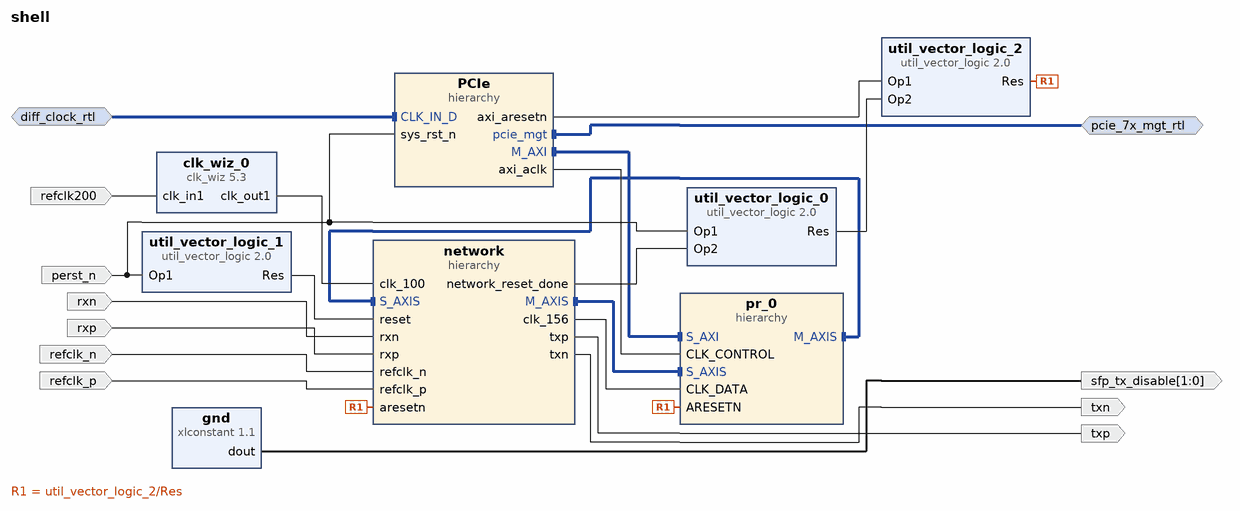
[diagram p0: block diagram of the top level]
# Vivado block design shell, xcku115-flva1517-2-e, Vivado 2016.4
create_bd_design shell

create_bd_intf_port -mode Master -vlnv xilinx.com:interface:pcie_7x_mgt_rtl:1.0 pcie_7x_mgt_rtl
create_bd_intf_port -mode Slave -vlnv xilinx.com:interface:diff_clock_rtl:1.0 diff_clock_rtl
set_property -dict {CONFIG.FREQ_HZ 100000000} [get_bd_intf_ports diff_clock_rtl]
create_bd_port -dir I rxn
create_bd_port -dir I rxp
create_bd_port -dir I refclk_n
create_bd_port -dir O txp
create_bd_port -dir O txn
create_bd_port -dir I refclk_p
create_bd_port -dir I perst_n
create_bd_port -dir I -type clk refclk200
set_property -dict {CONFIG.FREQ_HZ 200000000} [get_bd_ports refclk200]
create_bd_port -dir O -from 1 -to 0 sfp_tx_disable

create_bd_cell -type hier network
create_bd_cell -type ip -vlnv xilinx.com:ip:util_vector_logic:2.0 util_vector_logic_0
set_property -dict {CONFIG.C_SIZE 1} [get_bd_cells util_vector_logic_0]
create_bd_cell -type ip -vlnv xilinx.com:ip:util_vector_logic:2.0 util_vector_logic_1
set_property -dict {CONFIG.C_SIZE 1 CONFIG.C_OPERATION not} [get_bd_cells util_vector_logic_1]
create_bd_cell -type ip -vlnv xilinx.com:ip:clk_wiz:5.3 clk_wiz_0
set_property -dict {CONFIG.USE_LOCKED false CONFIG.USE_RESET false} [get_bd_cells clk_wiz_0]
create_bd_cell -type ip -vlnv xilinx.com:ip:xlconstant:1.1 gnd
set_property -dict {CONFIG.CONST_WIDTH 2 CONFIG.CONST_VAL 0} [get_bd_cells gnd]
create_bd_cell -type hier PCIe
create_bd_cell -type ip -vlnv xilinx.com:ip:util_vector_logic:2.0 util_vector_logic_2
set_property -dict {CONFIG.C_SIZE 1} [get_bd_cells util_vector_logic_2]
create_bd_cell -type hier pr_0

# ---- hierarchy /network ----
current_bd_instance /network
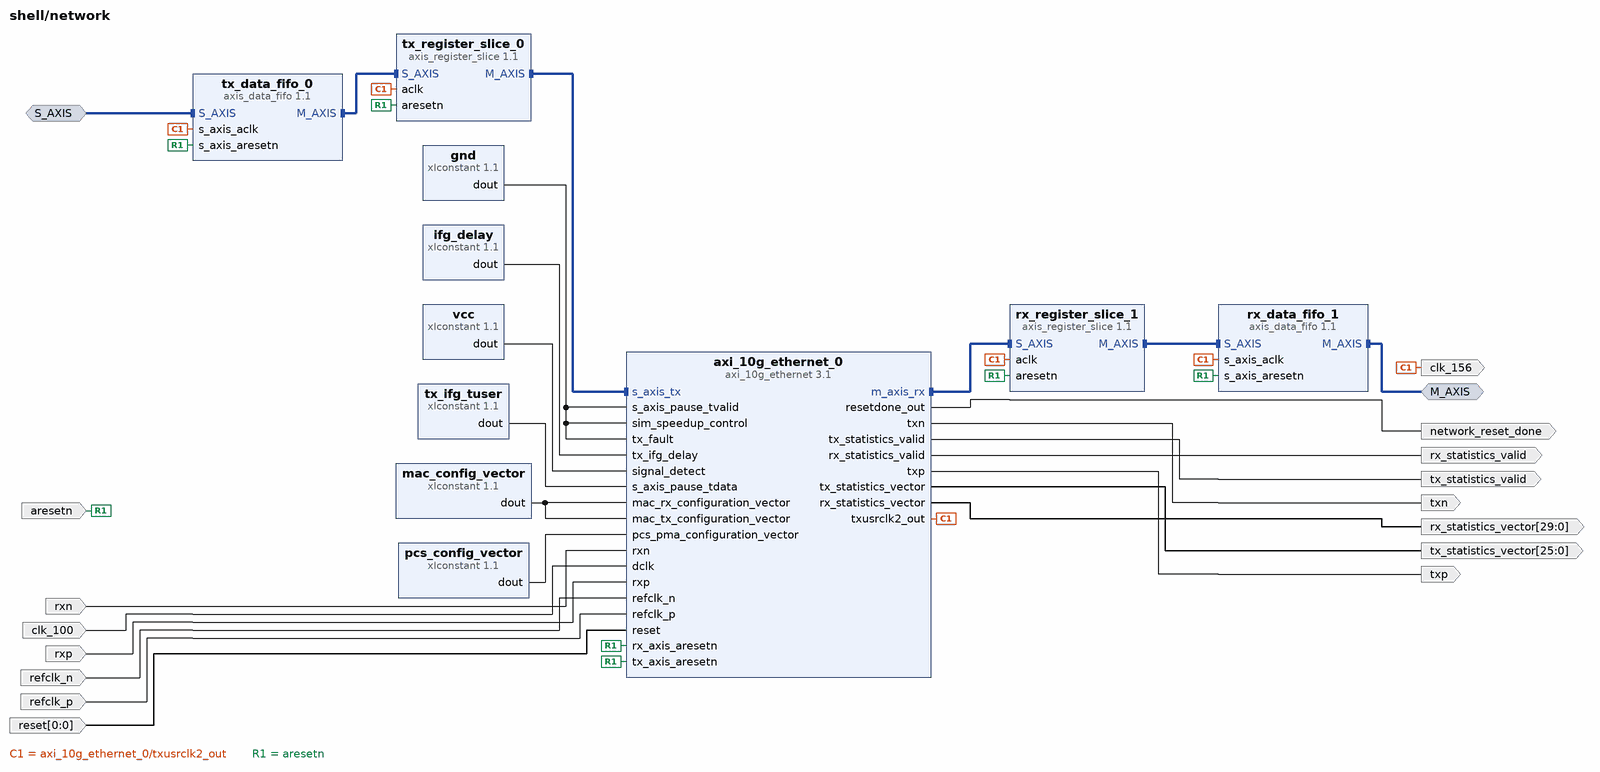
[diagram p1: block diagram inside /network]
create_bd_intf_pin -mode Slave -vlnv xilinx.com:interface:axis_rtl:1.0 S_AXIS
create_bd_intf_pin -mode Master -vlnv xilinx.com:interface:axis_rtl:1.0 M_AXIS
create_bd_pin -dir I rxn
create_bd_pin -dir I -type clk clk_100
create_bd_pin -dir I rxp
create_bd_pin -dir O -type clk clk_156
create_bd_pin -dir I -type rst aresetn
create_bd_pin -dir I refclk_n
create_bd_pin -dir O txp
create_bd_pin -dir O txn
create_bd_pin -dir O network_reset_done
create_bd_pin -dir I refclk_p
create_bd_pin -dir I -from 0 -to 0 -type rst reset
create_bd_pin -dir O tx_statistics_valid
create_bd_pin -dir O -from 25 -to 0 tx_statistics_vector
create_bd_pin -dir O rx_statistics_valid
create_bd_pin -dir O -from 29 -to 0 rx_statistics_vector

create_bd_cell -type ip -vlnv xilinx.com:ip:xlconstant:1.1 gnd
set_property -dict {CONFIG.CONST_VAL 0} [get_bd_cells gnd]
create_bd_cell -type ip -vlnv xilinx.com:ip:axis_register_slice:1.1 tx_register_slice_0
set_property -dict {CONFIG.TUSER_WIDTH 0} [get_bd_cells tx_register_slice_0]
create_bd_cell -type ip -vlnv xilinx.com:ip:axi_10g_ethernet:3.1 axi_10g_ethernet_0
set_property -dict [list \
  CONFIG.Management_Interface false \
  CONFIG.base_kr BASE-R \
  CONFIG.SupportLevel 1 \
  CONFIG.Locations X1Y16 \
] [get_bd_cells axi_10g_ethernet_0]
create_bd_cell -type ip -vlnv xilinx.com:ip:xlconstant:1.1 mac_config_vector
set_property -dict {CONFIG.CONST_WIDTH 80 CONFIG.CONST_VAL 22} [get_bd_cells mac_config_vector]
create_bd_cell -type ip -vlnv xilinx.com:ip:xlconstant:1.1 tx_ifg_tuser
set_property -dict {CONFIG.CONST_WIDTH 16 CONFIG.CONST_VAL 0} [get_bd_cells tx_ifg_tuser]
create_bd_cell -type ip -vlnv xilinx.com:ip:xlconstant:1.1 ifg_delay
set_property -dict {CONFIG.CONST_WIDTH 8 CONFIG.CONST_VAL 0} [get_bd_cells ifg_delay]
create_bd_cell -type ip -vlnv xilinx.com:ip:xlconstant:1.1 vcc
create_bd_cell -type ip -vlnv xilinx.com:ip:xlconstant:1.1 pcs_config_vector
set_property -dict {CONFIG.CONST_WIDTH 536 CONFIG.CONST_VAL 0} [get_bd_cells pcs_config_vector]
create_bd_cell -type ip -vlnv xilinx.com:ip:axis_register_slice:1.1 rx_register_slice_1
set_property -dict {CONFIG.TUSER_WIDTH 0} [get_bd_cells rx_register_slice_1]
create_bd_cell -type ip -vlnv xilinx.com:ip:axis_data_fifo:1.1 rx_data_fifo_1
set_property -dict {CONFIG.FIFO_MODE 2} [get_bd_cells rx_data_fifo_1]
create_bd_cell -type ip -vlnv xilinx.com:ip:axis_data_fifo:1.1 tx_data_fifo_0
set_property -dict {CONFIG.FIFO_MODE 2} [get_bd_cells tx_data_fifo_0]

# ---- hierarchy /PCIe ----
current_bd_instance /PCIe
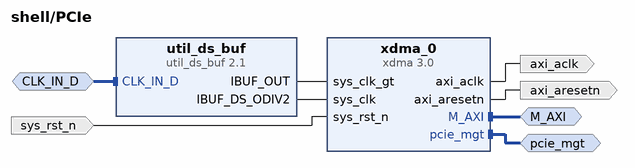
[diagram p2: block diagram inside /PCIe]
create_bd_intf_pin -mode Master -vlnv xilinx.com:interface:pcie_7x_mgt_rtl:1.0 pcie_mgt
create_bd_intf_pin -mode Master -vlnv xilinx.com:interface:aximm_rtl:1.0 M_AXI
create_bd_intf_pin -mode Slave -vlnv xilinx.com:interface:diff_clock_rtl:1.0 CLK_IN_D
create_bd_pin -dir I -type rst sys_rst_n
create_bd_pin -dir O -type clk axi_aclk
create_bd_pin -dir O -type rst axi_aresetn

create_bd_cell -type ip -vlnv xilinx.com:ip:xdma:3.0 xdma_0
set_property -dict [list \
  CONFIG.mode_selection Advanced \
  CONFIG.pl_link_cap_max_link_width X8 \
  CONFIG.pl_link_cap_max_link_speed 8.0_GT/s \
  CONFIG.axi_data_width 256_bit \
  CONFIG.axisten_freq 250 \
  CONFIG.pf0_device_id 8038 \
  CONFIG.pf0_interrupt_pin NONE \
  CONFIG.xdma_rnum_chnl 4 \
  CONFIG.xdma_wnum_chnl 4 \
  CONFIG.INS_LOSS_NYQ 5 \
  CONFIG.xdma_axi_intf_mm AXI_Memory_Mapped \
  CONFIG.cfg_mgmt_if false \
  CONFIG.ins_loss_profile Chip-to-Chip \
] [get_bd_cells xdma_0]
create_bd_cell -type ip -vlnv xilinx.com:ip:util_ds_buf:2.1 util_ds_buf
set_property -dict {CONFIG.C_BUF_TYPE IBUFDSGTE} [get_bd_cells util_ds_buf]

# ---- hierarchy /pr_0 ----
current_bd_instance /pr_0
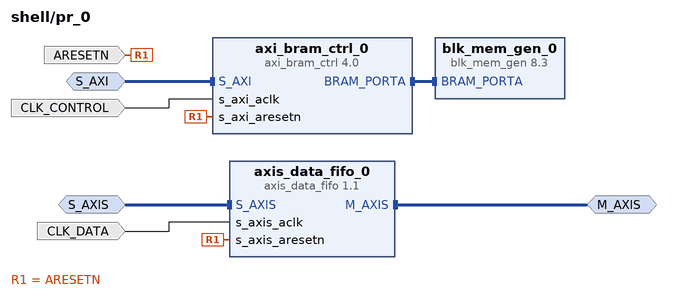
[diagram p3: block diagram inside /pr_0]
create_bd_intf_pin -mode Slave -vlnv xilinx.com:interface:aximm_rtl:1.0 S_AXI
create_bd_intf_pin -mode Master -vlnv xilinx.com:interface:axis_rtl:1.0 M_AXIS
create_bd_intf_pin -mode Slave -vlnv xilinx.com:interface:axis_rtl:1.0 S_AXIS
create_bd_pin -dir I -type clk CLK_CONTROL
create_bd_pin -dir I -type rst ARESETN
create_bd_pin -dir I -type clk CLK_DATA

create_bd_cell -type ip -vlnv xilinx.com:ip:axi_bram_ctrl:4.0 axi_bram_ctrl_0
set_property -dict {CONFIG.DATA_WIDTH 256 CONFIG.SINGLE_PORT_BRAM 1} [get_bd_cells axi_bram_ctrl_0]
create_bd_cell -type ip -vlnv xilinx.com:ip:blk_mem_gen:8.3 blk_mem_gen_0
create_bd_cell -type ip -vlnv xilinx.com:ip:axis_data_fifo:1.1 axis_data_fifo_0

# ---- connections ----

current_bd_instance /network
connect_bd_intf_net -intf_net axis_register_slice_0_M_AXIS [get_bd_intf_pins tx_register_slice_0/M_AXIS] [get_bd_intf_pins axi_10g_ethernet_0/s_axis_tx]
connect_bd_intf_net [get_bd_intf_pins axi_10g_ethernet_0/m_axis_rx] [get_bd_intf_pins rx_register_slice_1/S_AXIS]
connect_bd_intf_net -intf_net axis_register_slice_1_M_AXIS [get_bd_intf_pins rx_register_slice_1/M_AXIS] [get_bd_intf_pins rx_data_fifo_1/S_AXIS]
connect_bd_intf_net -intf_net axis_data_fifo_0_M_AXIS [get_bd_intf_pins tx_data_fifo_0/M_AXIS] [get_bd_intf_pins tx_register_slice_0/S_AXIS]
connect_bd_intf_net [get_bd_intf_pins S_AXIS] [get_bd_intf_pins tx_data_fifo_0/S_AXIS]
connect_bd_intf_net [get_bd_intf_pins M_AXIS] [get_bd_intf_pins rx_data_fifo_1/M_AXIS]
connect_bd_net [get_bd_pins gnd/dout] \
  [get_bd_pins axi_10g_ethernet_0/s_axis_pause_tvalid] [get_bd_pins axi_10g_ethernet_0/tx_fault] \
  [get_bd_pins axi_10g_ethernet_0/sim_speedup_control]
connect_bd_net [get_bd_pins ifg_delay/dout] [get_bd_pins axi_10g_ethernet_0/tx_ifg_delay]
connect_bd_net [get_bd_pins vcc/dout] [get_bd_pins axi_10g_ethernet_0/signal_detect]
connect_bd_net [get_bd_pins tx_ifg_tuser/dout] [get_bd_pins axi_10g_ethernet_0/s_axis_pause_tdata]
connect_bd_net [get_bd_pins mac_config_vector/dout] \
  [get_bd_pins axi_10g_ethernet_0/mac_tx_configuration_vector] [get_bd_pins axi_10g_ethernet_0/mac_rx_configuration_vector]
connect_bd_net [get_bd_pins pcs_config_vector/dout] [get_bd_pins axi_10g_ethernet_0/pcs_pma_configuration_vector]
connect_bd_net [get_bd_pins rxn] [get_bd_pins axi_10g_ethernet_0/rxn]
connect_bd_net -net dclk_1 [get_bd_pins clk_100] [get_bd_pins axi_10g_ethernet_0/dclk]
connect_bd_net [get_bd_pins rxp] [get_bd_pins axi_10g_ethernet_0/rxp]
connect_bd_net [get_bd_pins axi_10g_ethernet_0/txusrclk2_out] \
  [get_bd_pins clk_156] [get_bd_pins rx_register_slice_1/aclk] [get_bd_pins tx_register_slice_0/aclk] \
  [get_bd_pins rx_data_fifo_1/s_axis_aclk] [get_bd_pins tx_data_fifo_0/s_axis_aclk]
connect_bd_net -net tx_axis_aresetn_1 [get_bd_pins aresetn] \
  [get_bd_pins axi_10g_ethernet_0/tx_axis_aresetn] [get_bd_pins axi_10g_ethernet_0/rx_axis_aresetn] \
  [get_bd_pins rx_register_slice_1/aresetn] [get_bd_pins tx_register_slice_0/aresetn] \
  [get_bd_pins rx_data_fifo_1/s_axis_aresetn] [get_bd_pins tx_data_fifo_0/s_axis_aresetn]
connect_bd_net [get_bd_pins refclk_n] [get_bd_pins axi_10g_ethernet_0/refclk_n]
connect_bd_net [get_bd_pins axi_10g_ethernet_0/txp] [get_bd_pins txp]
connect_bd_net [get_bd_pins axi_10g_ethernet_0/txn] [get_bd_pins txn]
connect_bd_net [get_bd_pins axi_10g_ethernet_0/resetdone_out] [get_bd_pins network_reset_done]
connect_bd_net [get_bd_pins refclk_p] [get_bd_pins axi_10g_ethernet_0/refclk_p]
connect_bd_net [get_bd_pins axi_10g_ethernet_0/tx_statistics_valid] [get_bd_pins tx_statistics_valid]
connect_bd_net [get_bd_pins axi_10g_ethernet_0/tx_statistics_vector] [get_bd_pins tx_statistics_vector]
connect_bd_net [get_bd_pins axi_10g_ethernet_0/rx_statistics_valid] [get_bd_pins rx_statistics_valid]
connect_bd_net [get_bd_pins axi_10g_ethernet_0/rx_statistics_vector] [get_bd_pins rx_statistics_vector]
connect_bd_net [get_bd_pins reset] [get_bd_pins axi_10g_ethernet_0/reset]

current_bd_instance /PCIe
connect_bd_intf_net [get_bd_intf_pins pcie_mgt] [get_bd_intf_pins xdma_0/pcie_mgt]
connect_bd_intf_net [get_bd_intf_pins M_AXI] [get_bd_intf_pins xdma_0/M_AXI]
connect_bd_intf_net [get_bd_intf_pins CLK_IN_D] [get_bd_intf_pins util_ds_buf/CLK_IN_D]
connect_bd_net [get_bd_pins sys_rst_n] [get_bd_pins xdma_0/sys_rst_n]
connect_bd_net [get_bd_pins xdma_0/axi_aclk] [get_bd_pins axi_aclk]
connect_bd_net [get_bd_pins xdma_0/axi_aresetn] [get_bd_pins axi_aresetn]
connect_bd_net [get_bd_pins util_ds_buf/IBUF_OUT] [get_bd_pins xdma_0/sys_clk_gt]
connect_bd_net [get_bd_pins util_ds_buf/IBUF_DS_ODIV2] [get_bd_pins xdma_0/sys_clk]

current_bd_instance /pr_0
connect_bd_intf_net [get_bd_intf_pins axi_bram_ctrl_0/BRAM_PORTA] [get_bd_intf_pins blk_mem_gen_0/BRAM_PORTA]
connect_bd_intf_net [get_bd_intf_pins S_AXI] [get_bd_intf_pins axi_bram_ctrl_0/S_AXI]
connect_bd_intf_net [get_bd_intf_pins M_AXIS] [get_bd_intf_pins axis_data_fifo_0/M_AXIS]
connect_bd_intf_net [get_bd_intf_pins S_AXIS] [get_bd_intf_pins axis_data_fifo_0/S_AXIS]
connect_bd_net -net s_axi_aclk_1 [get_bd_pins CLK_CONTROL] [get_bd_pins axi_bram_ctrl_0/s_axi_aclk]
connect_bd_net -net s_axi_aresetn_1 [get_bd_pins ARESETN] [get_bd_pins axi_bram_ctrl_0/s_axi_aresetn] [get_bd_pins axis_data_fifo_0/s_axis_aresetn]
connect_bd_net -net s_axis_aclk_1 [get_bd_pins CLK_DATA] [get_bd_pins axis_data_fifo_0/s_axis_aclk]

current_bd_instance /
connect_bd_intf_net [get_bd_intf_pins PCIe/M_AXI] [get_bd_intf_pins pr_0/S_AXI]
connect_bd_intf_net [get_bd_intf_pins network/S_AXIS] [get_bd_intf_pins pr_0/M_AXIS]
connect_bd_intf_net [get_bd_intf_pins network/M_AXIS] [get_bd_intf_pins pr_0/S_AXIS]
connect_bd_intf_net [get_bd_intf_ports pcie_7x_mgt_rtl] [get_bd_intf_pins PCIe/pcie_mgt]
connect_bd_intf_net [get_bd_intf_ports diff_clock_rtl] [get_bd_intf_pins PCIe/CLK_IN_D]
connect_bd_net [get_bd_ports rxn] [get_bd_pins network/rxn]
connect_bd_net [get_bd_ports rxp] [get_bd_pins network/rxp]
connect_bd_net [get_bd_ports refclk_n] [get_bd_pins network/refclk_n]
connect_bd_net [get_bd_pins network/txp] [get_bd_ports txp]
connect_bd_net [get_bd_pins network/txn] [get_bd_ports txn]
connect_bd_net [get_bd_ports refclk_p] [get_bd_pins network/refclk_p]
connect_bd_net [get_bd_ports perst_n] [get_bd_pins util_vector_logic_0/Op1] [get_bd_pins util_vector_logic_1/Op1] [get_bd_pins PCIe/sys_rst_n]
connect_bd_net [get_bd_pins network/network_reset_done] [get_bd_pins util_vector_logic_0/Op2]
connect_bd_net [get_bd_pins util_vector_logic_1/Res] [get_bd_pins network/reset]
connect_bd_net -net refclk200_1 [get_bd_ports refclk200] [get_bd_pins clk_wiz_0/clk_in1]
connect_bd_net -net microblaze_0_Clk [get_bd_pins clk_wiz_0/clk_out1] [get_bd_pins network/clk_100]
connect_bd_net [get_bd_pins gnd/dout] [get_bd_ports sfp_tx_disable]
connect_bd_net [get_bd_pins PCIe/axi_aresetn] [get_bd_pins util_vector_logic_2/Op1]
connect_bd_net [get_bd_pins util_vector_logic_0/Res] [get_bd_pins util_vector_logic_2/Op2]
connect_bd_net [get_bd_pins util_vector_logic_2/Res] [get_bd_pins network/aresetn] [get_bd_pins pr_0/ARESETN]
connect_bd_net [get_bd_pins PCIe/axi_aclk] [get_bd_pins pr_0/CLK_CONTROL]
connect_bd_net [get_bd_pins network/clk_156] [get_bd_pins pr_0/CLK_DATA]

# ---- address map ----
assign_bd_address -offset 0x00000000C0000000 -range 8K -target_address_space [get_bd_addr_spaces PCIe/xdma_0/M_AXI] [get_bd_addr_segs pr_0/axi_bram_ctrl_0/S_AXI/Mem0]

validate_bd_design
save_bd_design
